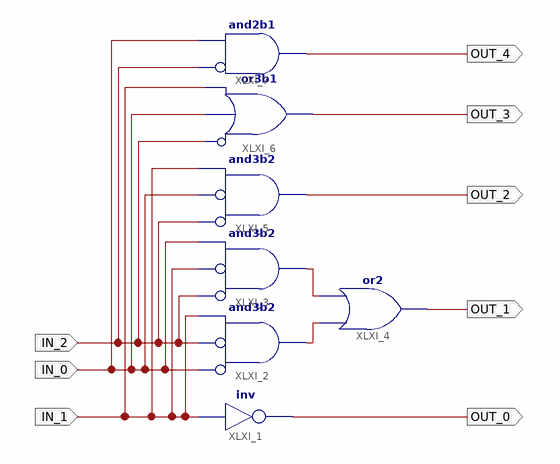
[diagram p0: schematic sheet 1]
// Xilinx ISE schematic My3To5Decoder.sch (spartan3a) as structural Verilog: 7 symbols, 8 ports
module My3To5Decoder (
  input  IN_1,
  input  IN_0,
  input  IN_2,
  output OUT_0,
  output OUT_1,
  output OUT_2,
  output OUT_3,
  output OUT_4
);

  wire XLXN_3, XLXN_4;

  not XLXI_1 (OUT_0, IN_1);
  and XLXI_2 (XLXN_4, ~IN_0, ~IN_2, IN_1);  // and3b2
  and XLXI_3 (XLXN_3, ~IN_2, ~IN_1, IN_0);  // and3b2
  or XLXI_4 (OUT_1, XLXN_4, XLXN_3);
  and XLXI_5 (OUT_2, ~IN_2, ~IN_0, IN_1);  // and3b2
  or XLXI_6 (OUT_3, ~IN_2, IN_0, IN_1);  // or3b1
  and XLXI_7 (OUT_4, ~IN_2, IN_0);  // and2b1
endmodule
